# Altium schematic sheet 电机驱动_电流检测原理图.SchDoc
size A4
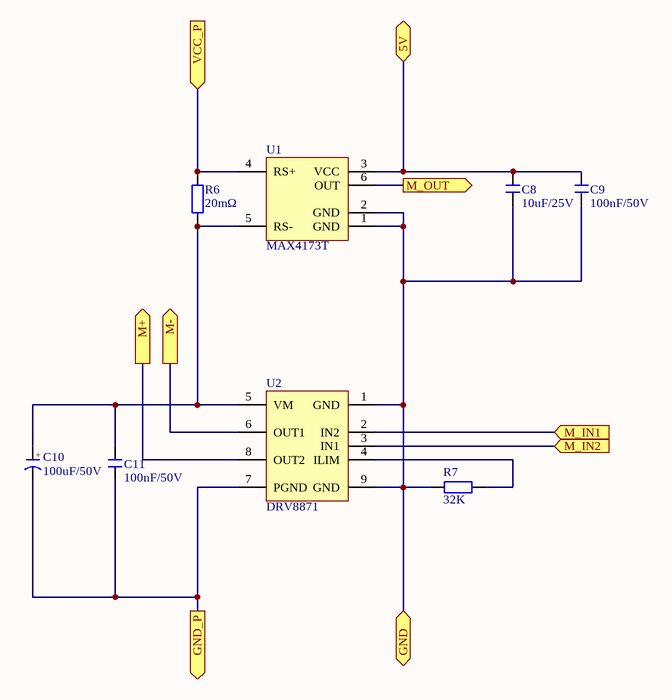
[diagram p0: 电机驱动_电流检测原理图.SchDoc]

## Parts
C8  10uF/25V  [C 0603_M]
C9  100nF/50V  [C 0603_M]
C10  100uF/50V  [CAP 3.5*8*11.5]
C11  100nF/50V  [C 0603_M]
R6  20mΩ  [R 2512_M]
R7  32K  [R 0603_M]
U1  MAX4173T  [SOT23-6N]
U2  DRV8871  [ESOP8_N]

## Ports
5V (bidir), GND (bidir), GND_P (out), M+ (out), M- (out), M_IN1 (in), M_IN2 (in), M_OUT (out), VCC_P (in)

## Nets
5V: C8.1 C9.1 U1.3(VCC) ; port 5V
GND: C8.2 C9.2 R7.1 U1.1(GND) U1.2(GND) U2.1(GND) U2.9(GND) ; port GND
GND_P: C10.2(K) C11.1 U2.7(PGND) ; port GND_P
M+: U2.8(OUT2) ; port M+
M-: U2.6(OUT1) ; port M-
M_IN1: U2.2(IN2) ; port M_IN1
M_IN2: U2.3(IN1) ; port M_IN2
M_OUT: U1.6(OUT) ; port M_OUT
VCC_P: R6.1 U1.4(RS+) ; port VCC_P
NetC10_1: C10.1(A) C11.2 R6.2 U1.5(RS-) U2.5(VM)
NetR7_2: R7.2 U2.4(ILIM)

## Notes on the sheet
- (in symbol C-CAP) +

## Library data of the parts
C8 C9 C11 = C: 无极性贴片电容; 版权归属: 源创客; 材质: X7R; BOM名称: 无极性贴片电容; 学习资源: www.ooocke.com
C10 = C-CAP: 直插电解电容; 版权归属: 源创客; BOM名称: 直插电解电容; 学习资源: www.ooocke.com
R6 R7 = R: 贴片电阻; 版权归属: 源创客; BOM名称: 贴片电阻; 学习资源: www.ooocke.com
U1 = MAX4173: 高端电流检测; 版权归属: 源创客; BOM名称: 高端电流检测; 学习资源: www.ooocke.com
U2 = DRV8872: 电机驱动芯片